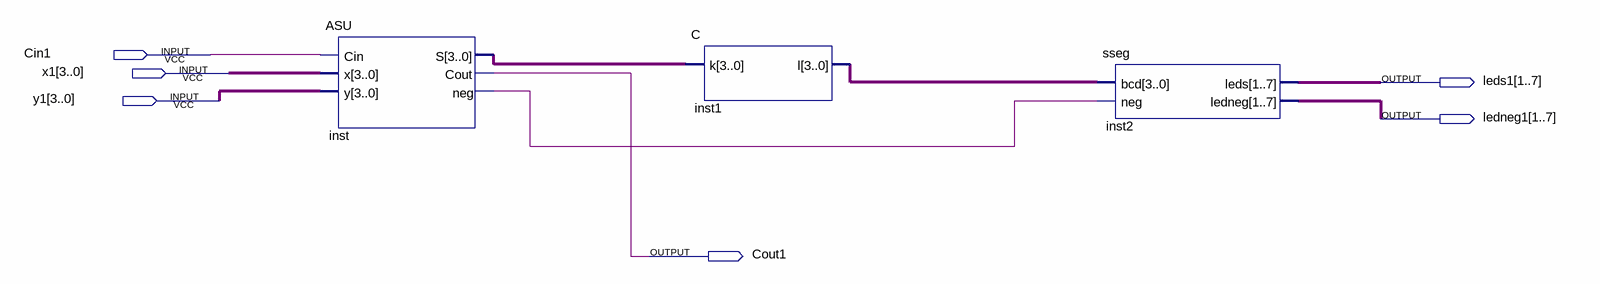
[diagram p0: schematic sheet]
// Quartus schematic CombinedASUC.bdf as structural Verilog: 3 symbols, 6 pins
module CombinedASUC (
  input  Cin1,
  input  [3:0] x1,
  input  [3:0] y1,
  output [1:7] leds1,
  output [1:7] ledneg1,
  output Cout1
);

  wire inst_neg;
  wire [3:0] inst1_l, inst_s;

  ASU inst (.Cin(Cin1), .x(x1), .y(y1), .S(inst_s), .Cout(Cout1), .neg(inst_neg));
  C inst1 (.k(inst_s), .l(inst1_l));
  sseg inst2 (.bcd(inst1_l), .neg(inst_neg), .leds(leds1), .ledneg(ledneg1));
endmodule
